# Altium project TCS-1900.PrjPcb
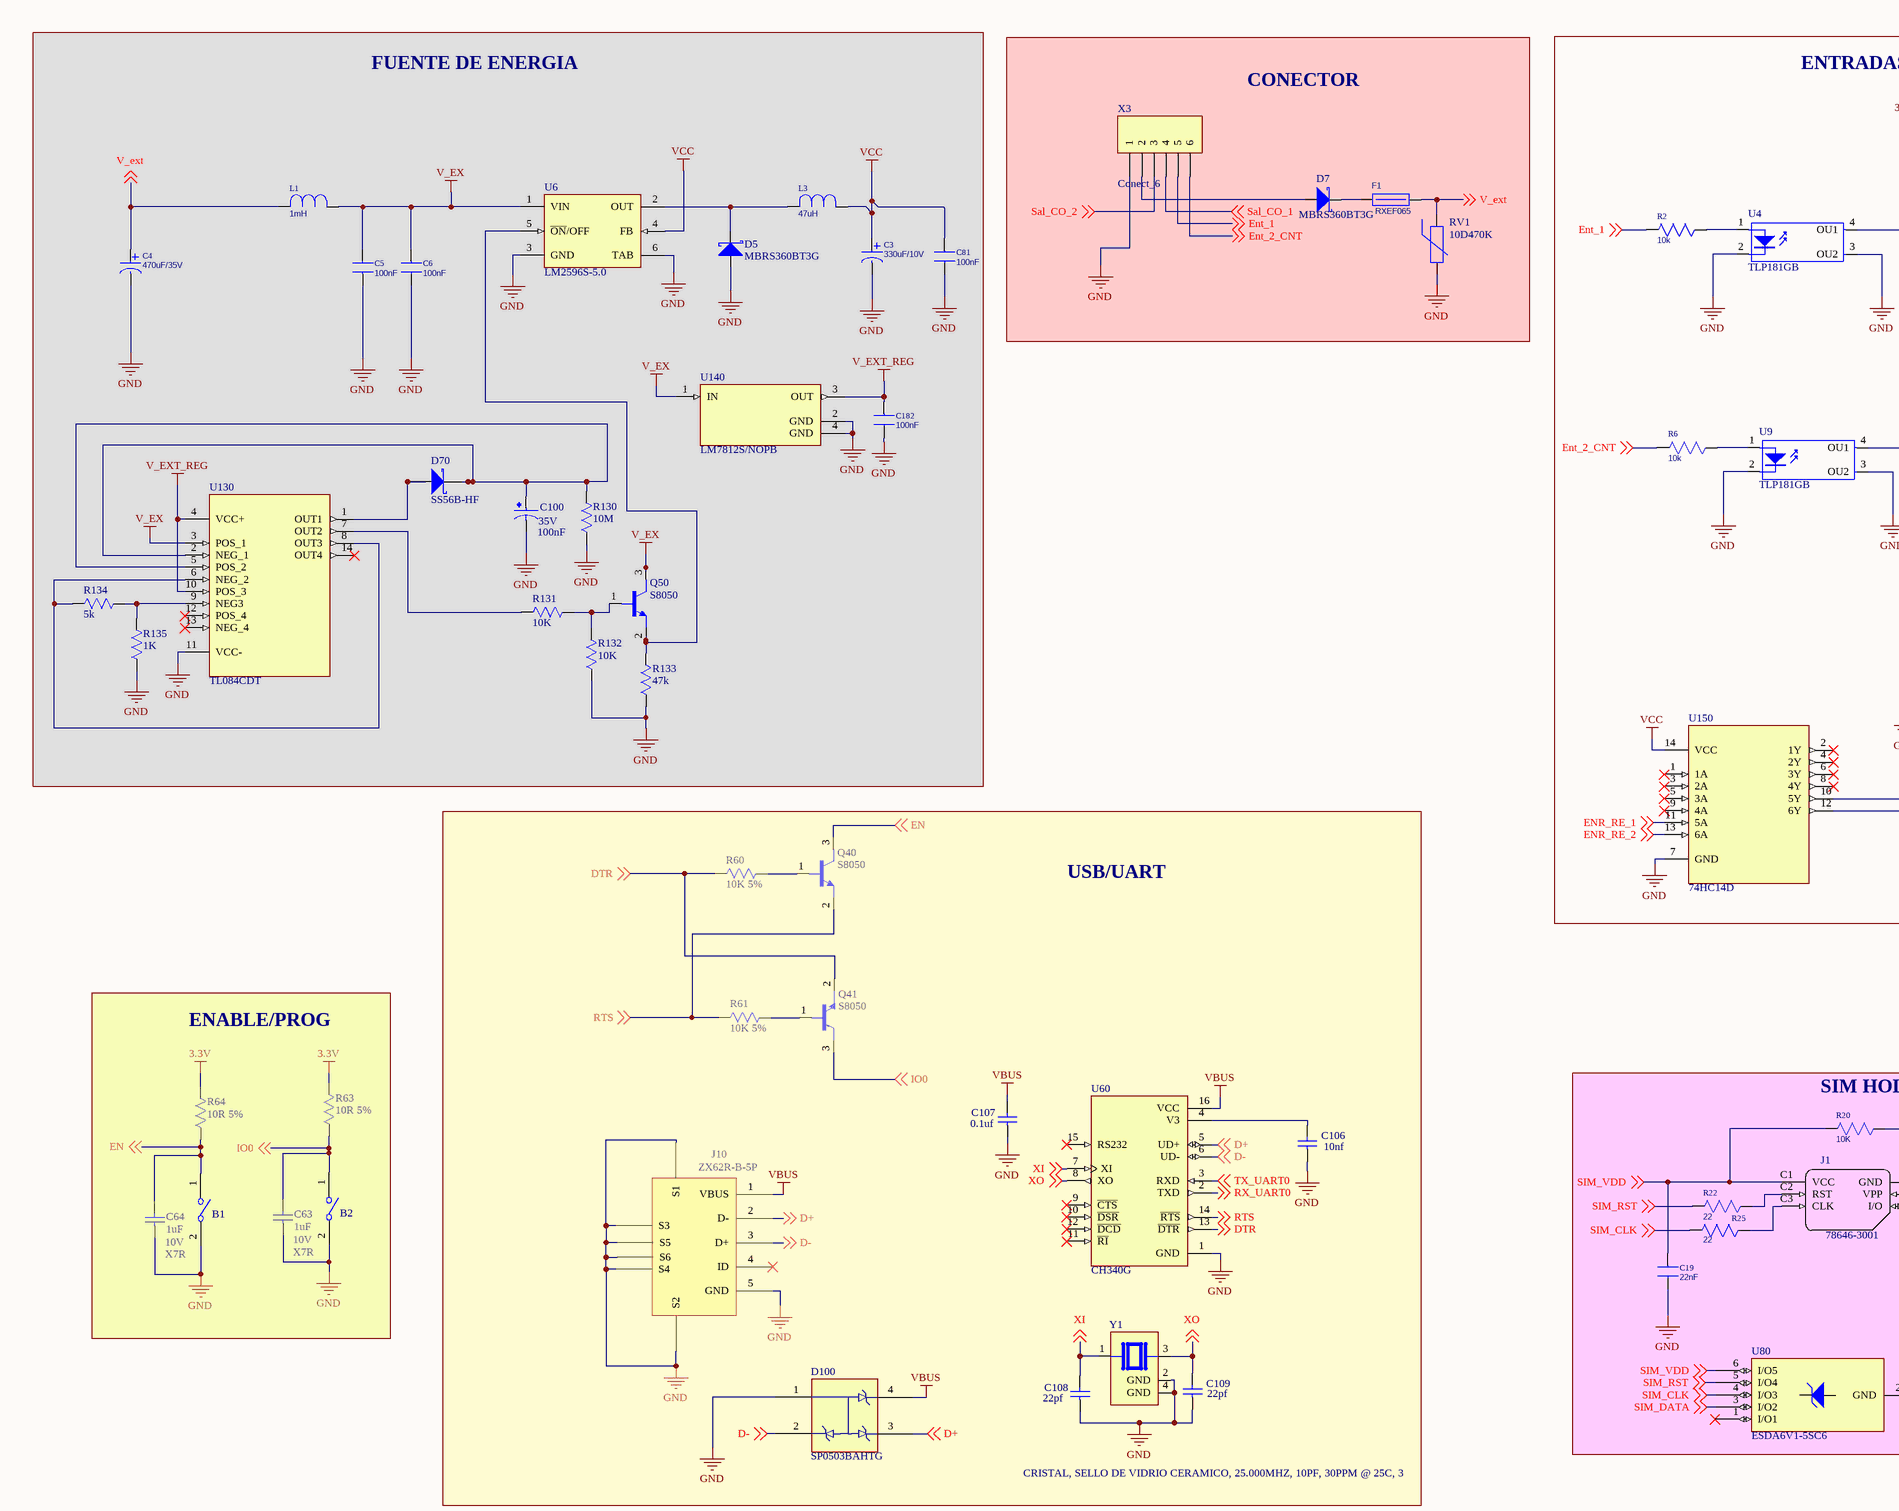
[diagram p0: TCS-1900.SchDoc, top left]
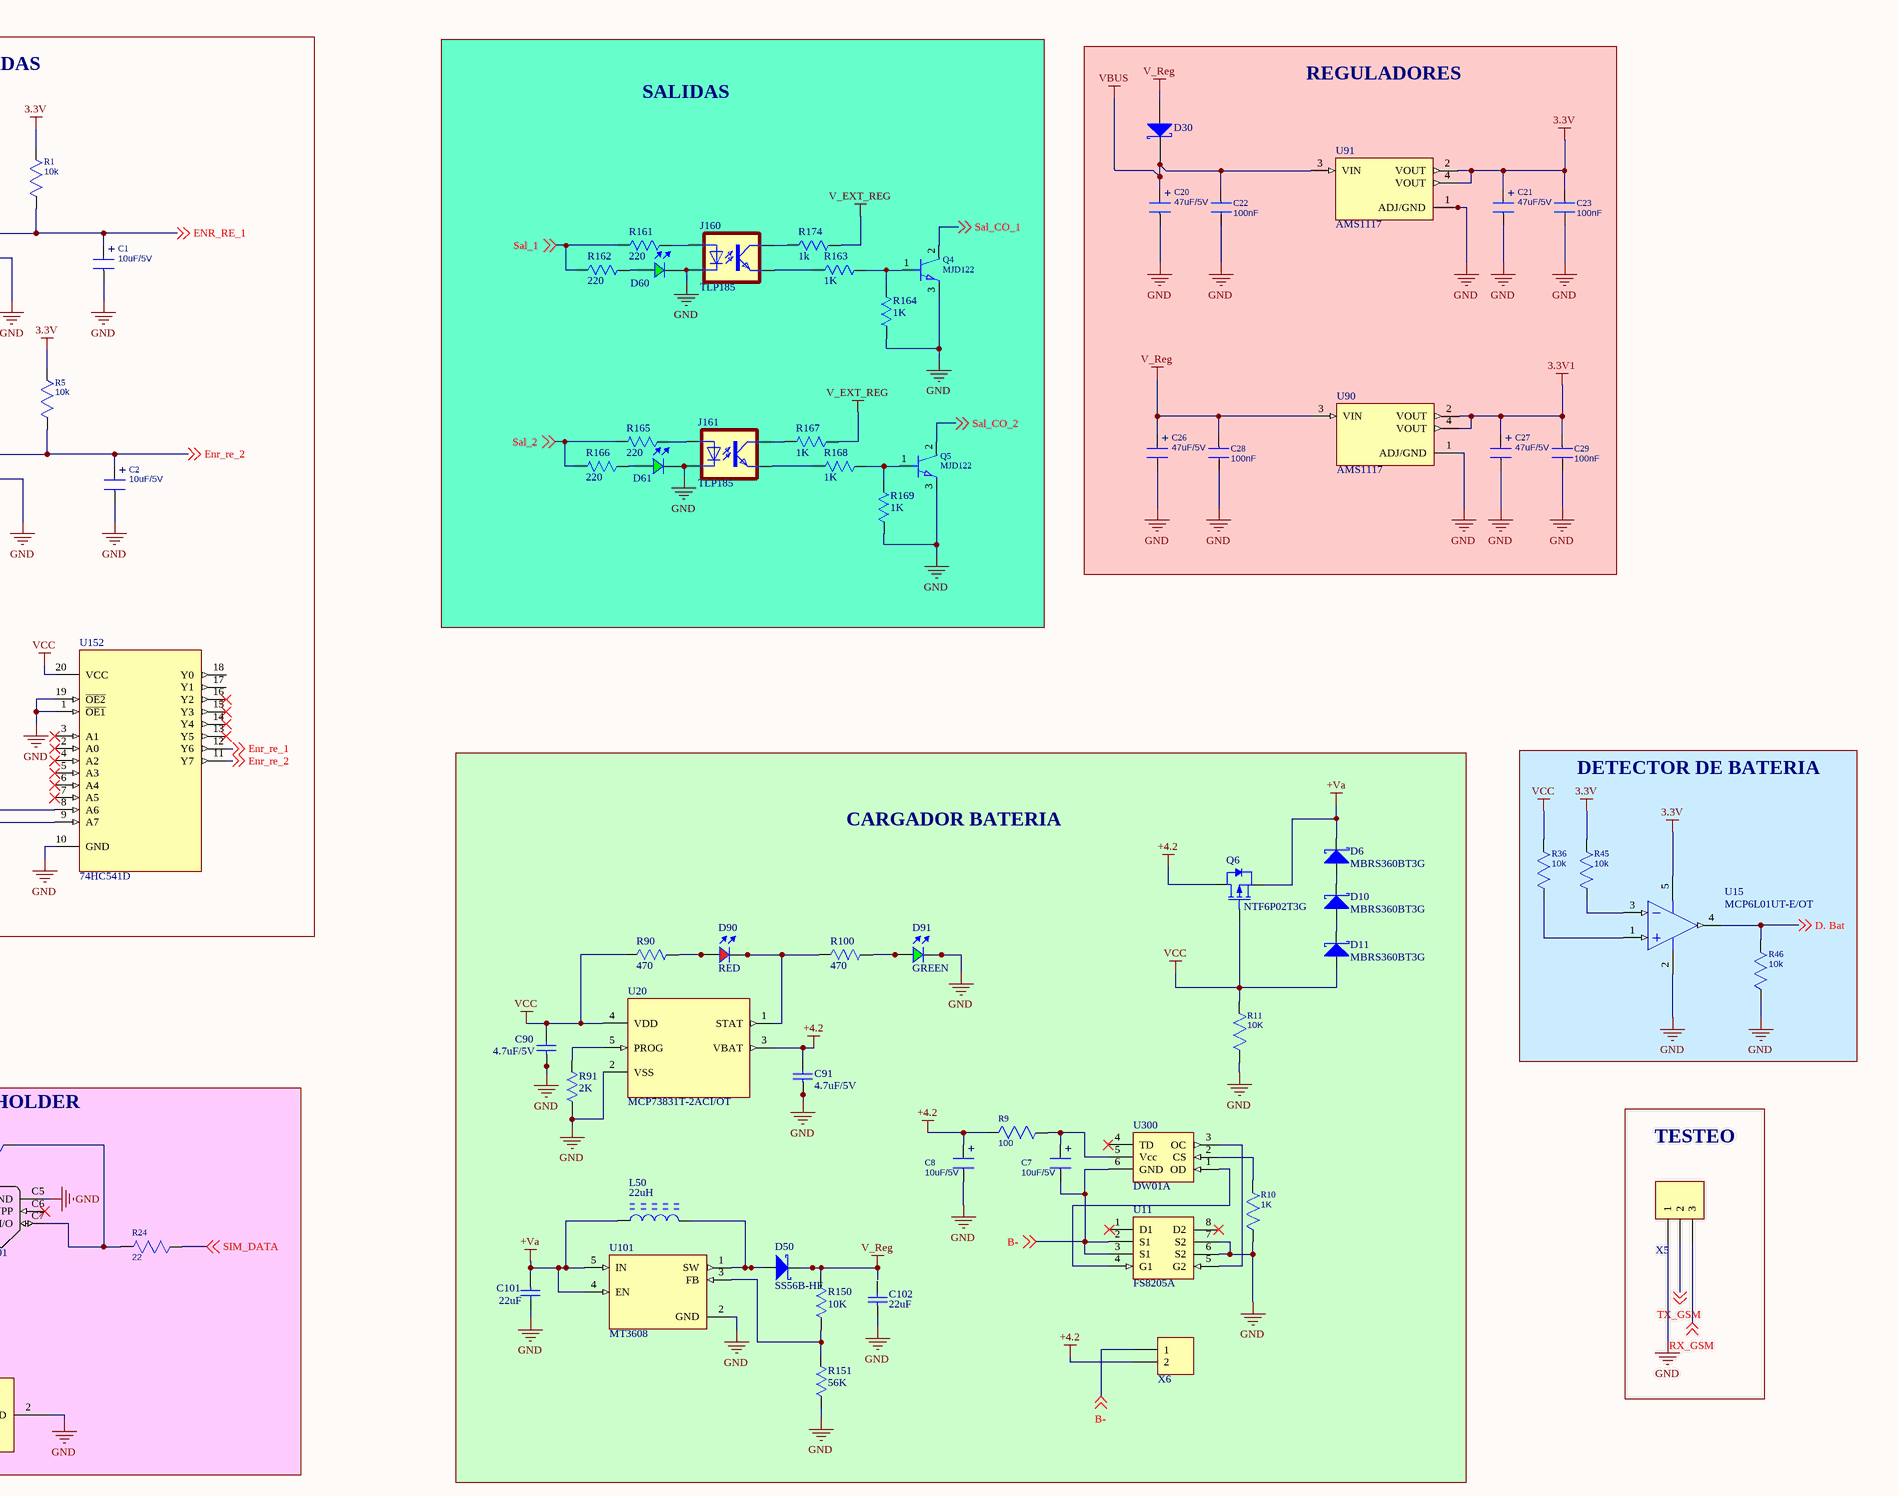
[diagram p1: TCS-1900.SchDoc, top right]
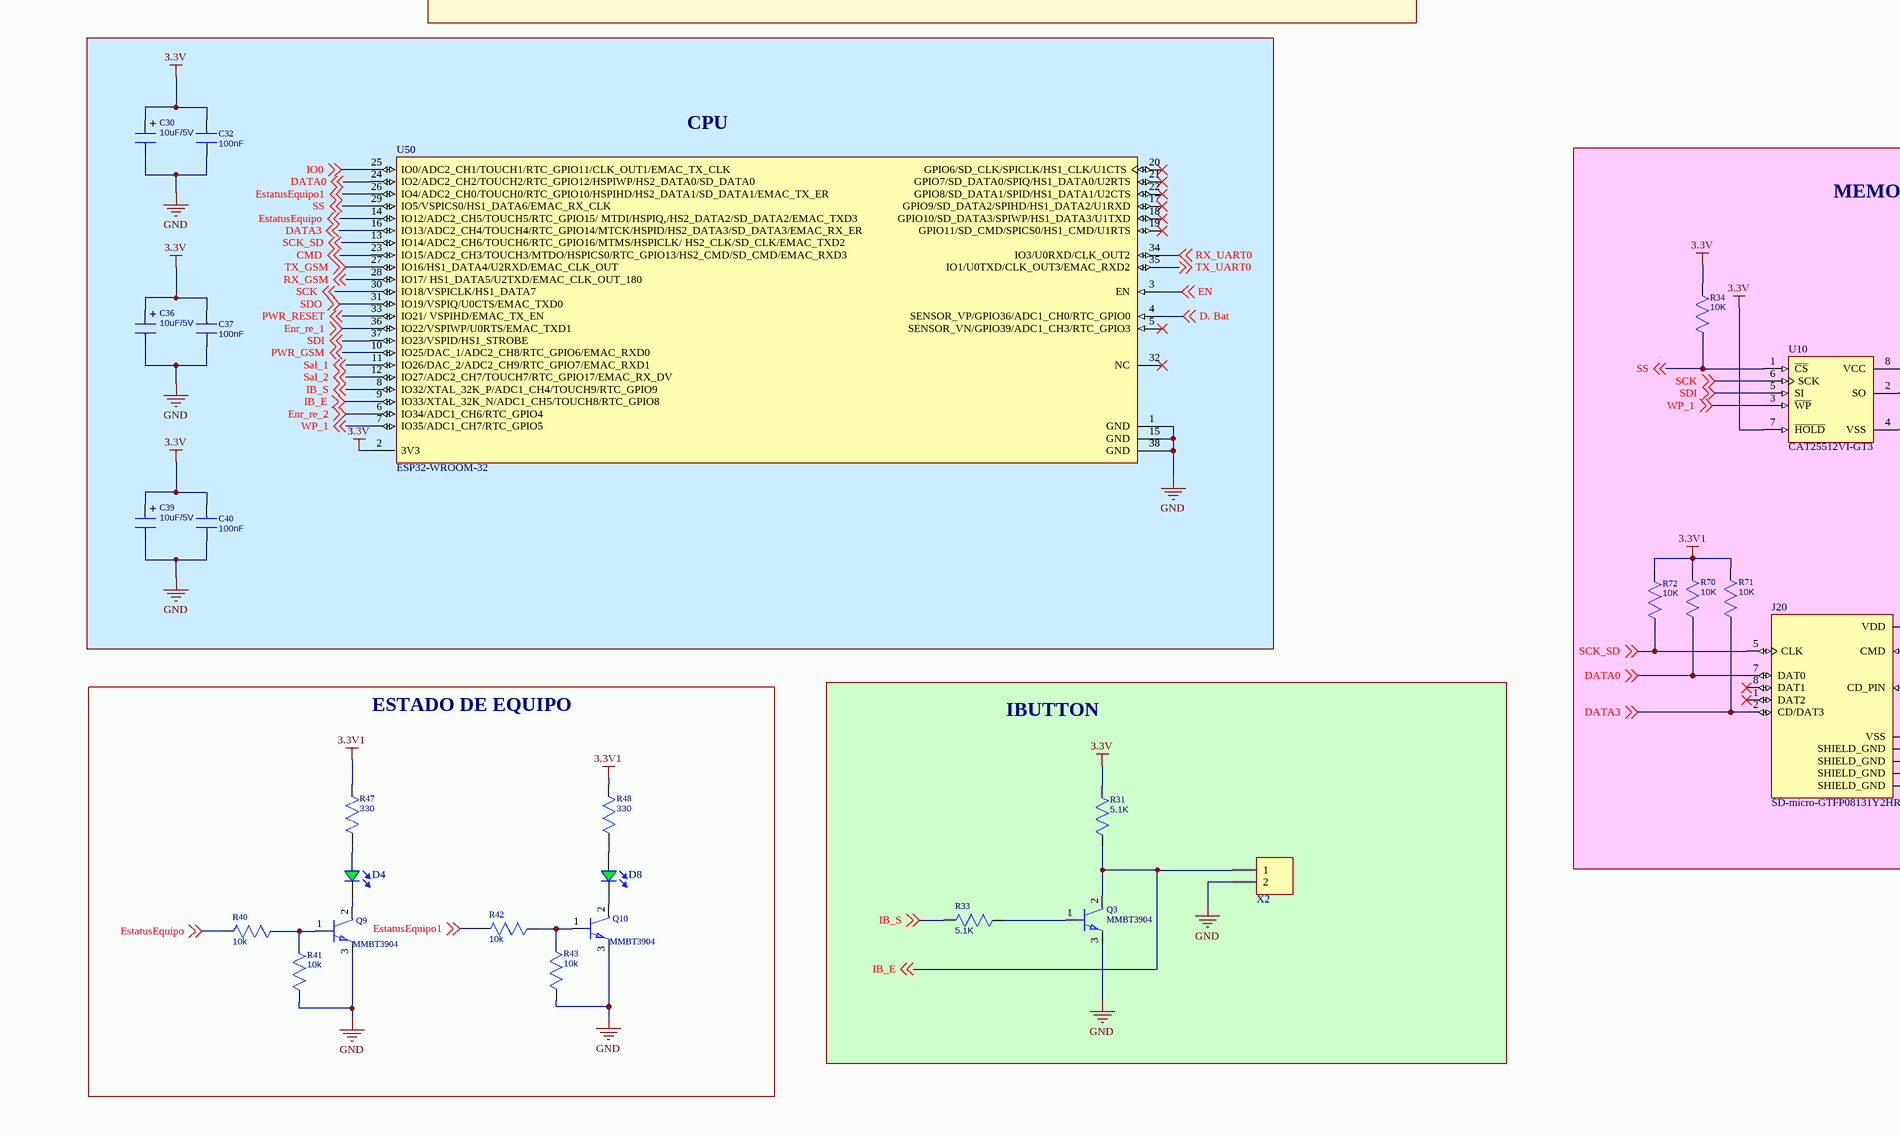
[diagram p2: TCS-1900.SchDoc, bottom left]
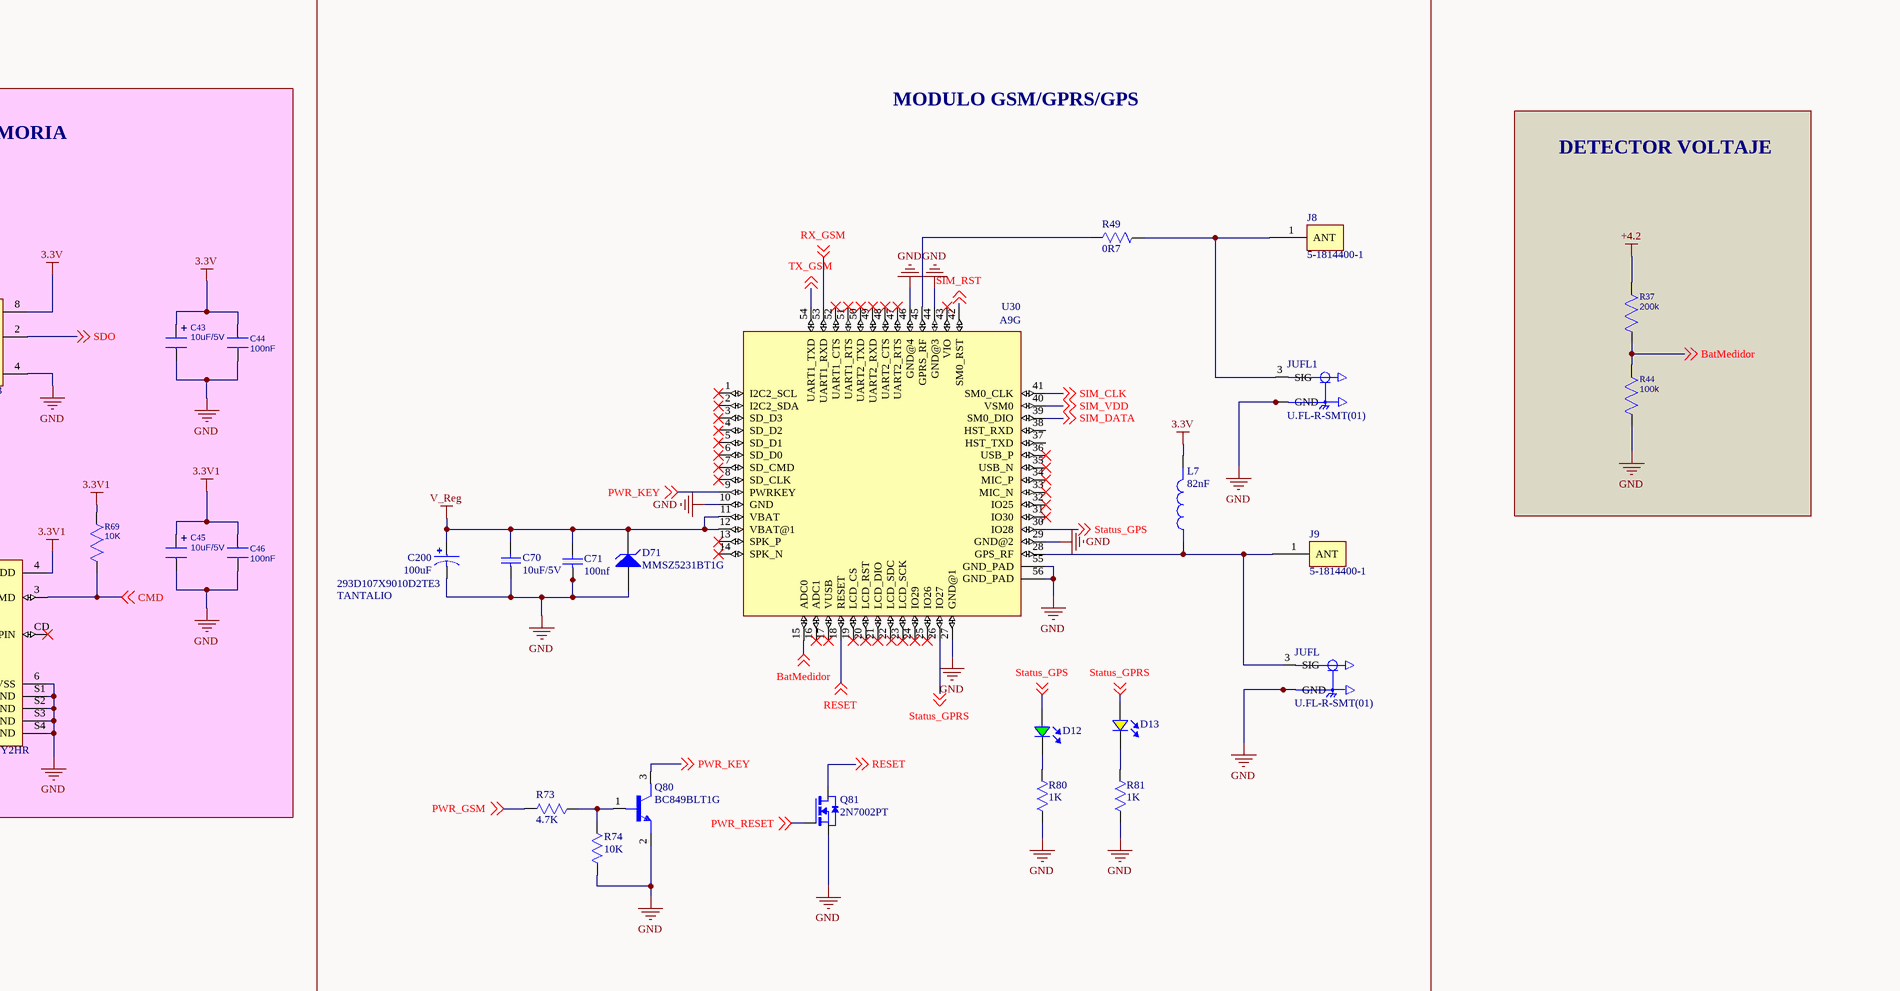
[diagram p3: TCS-1900.SchDoc, bottom right]
1 sheet, 172 parts. Net scope: global (net labels, ports and power ports of the same name join across sheets).
Board file: TCS-1900.PcbDoc

## Sheet TCS-1900.SchDoc
size A1

### Parts
B1  buton-SMD  [SW_147873-2]  (value not drawn)
B2  buton-SMD  [SW_147873-2]  (value not drawn)
C1  10uF/5V  [CT_0805]
C2  10uF/5V  [CT_0805]
C3  330uF/10V  [CPM7343-31]
C4  470uF/35V  [Cap_8x10]
C5  100nF  [Cap_poly]
C6  100nF  [C_0805]
C7  10uF/5V  [CT_0805]
C8  10uF/5V  [CT_0805]
C19  22nF  [C_0805]
C20  47uF/5V  [CT_0805]
C21  47uF/5V  [CT_0805]
C22  100nF  [C_0805]
C23  100nF  [C_0805]
C26  47uF/5V  [CT_0805]
C27  47uF/5V  [CT_0805]
C28  100nF  [C_0805]
C29  100nF  [C_0805]
C30  10uF/5V  [CT_0805]
C32  100nF  [C_0805]
C36  10uF/5V  [CT_0805]
C37  100nF  [C_0805]
C39  10uF/5V  [CT_0805]
C40  100nF  [C_0805]
C43  10uF/5V  [CT_0805]
C44  100nF  [C_0805]
C45  10uF/5V  [CT_0805]
C46  100nF  [C_0805]
C63  1uF  tension: 10V  tipo: X7R  [C_0805-3D]
C64  1uF  tension: 10V  tipo: X7R  [C_0805-3D]
C70  10uF/5V  [C_0805-3D]
C71  100nf  [C_0805-3D]
C81  100nF  [C_0805]
C90  4.7uF/5V  [C_0805-3D]
C91  4.7uF/5V  [C_0805-3D]
C100  value 100nF  max volt: 35V  [CAP_EEEFP1V221AV - duplicate]  (hidden comment: CAP)
C101  value 22uF  [C_0805-3D]  (hidden comment: capacitor caramico)
C102  value 22uF  [C_0805-3D]  (hidden comment: capacitor caramico)
C106  value 10nf  [C_0805-3D]  (hidden comment: capacitor caramico)
C107  value 0.1uf  [C_0805-3D]  (hidden comment: capacitor caramico)
C108  value 22pf  [C_0805-3D]  (hidden comment: capacitor caramico)
C109  value 22pf  [C_0805-3D]  (hidden comment: capacitor caramico)
C182  100nF  [C_0805]
C200  293D107X9010D2TE3  value 100uF  tipo: TANTALIO  [CAP-TANTALIO-PM7343X310N]
D4  LTST-C171GKT  [D_0805-GREEN]  (value not drawn)
D5  MBRS360BT3G  [p_403]
D6  MBRS360BT3G  [p_403]
D7  MBRS360BT3G  [p_403]
D8  LTST-C171GKT  [D_0805-GREEN]  (value not drawn)
D10  MBRS360BT3G  [p_403]
D11  MBRS360BT3G  [p_403]
D12  LTST-C171GKT  [D_0805-GREEN]  (value not drawn)
D13  LTST-C171GKT  [D_0805 - YELOW]  (value not drawn)
D30  SS56B-HF  [SS56B-HF DO-214AA (SMB)]  (value not drawn)
D50  SS56B-HF  [SS56B-HF DO-214AA (SMB)]
D60  LTST-C171GKT  [D_0805-GREEN]  (value not drawn)
D61  LTST-C171GKT  [D_0805-GREEN]  (value not drawn)
D70  SS56B-HF  [SS56B-HF DO-214AA (SMB)]
D71  MMSZ5231BT1G  [SOD_123]
D90  RED  [D_0805-RED]
D91  GREEN  [D_0805-GREEN]
D100  SP0503BAHTG  [SOT143]
F1  RXEF065  [Polyswitch]
J1  78646-3001  [MICRO-SIM_CARD_HOLDER_78646-3001(Primary)]
J8  5-1814400-1  [5-1814400-1]
J9  5-1814400-1  [5-1814400-1]
J10  ZX62R-B-5P  [HRS_ZX62R-B-5P]
J20  SD-micro-GTFP08131Y2HR  [AMPHENOL_GTFP08131Y2HR]
J160  TLP185  [SOP-4-2.54MM]
J161  TLP185  [SOP-4-2.54MM]
JUFL  U.FL-R-SMT(01)  [HRS_U.FL-R-SMT(01)]
JUFL1  U.FL-R-SMT(01)  [HRS_U.FL-R-SMT(01)]
L1  1mH  [Inductor_per]
L3  47uH  [CDRH127]
L7  82nF  [IND_CPI0805G1R5R-10]
L50  value 22uH  [DE0703-33]  (hidden comment: DE0703-33)
Q3  MMBT3904  [SOT23-npn]
Q4  MJD122  [DPAK]
Q5  MJD122  [DPAK]
Q6  NTF6P02T3G  [SOT223A]
Q9  MMBT3904  [SOT23-npn]
Q10  MMBT3904  [SOT23-npn]
Q40  S8050  [SOT-23]
Q41  S8050  [SOT-23]
Q50  S8050  [SOT-23]
Q80  BC849BLT1G  [SOT-23-3 (TO-236)]
Q81  2N7002PT  [SOT-416]
R1  10k  [R_0805]
R2  10k  [R_0805]
R5  10k  [R_0805]
R6  10k  [R_0805]
R9  100  [R_0805]
R10  1K  [R_0805]
R11  10K  [R_0805]
R20  10K  [R_0805]
R22  22  [R_0805]
R24  22  [R_0805]
R25  22  [R_0805]
R31  5.1K  [R_0805]
R33  5.1K  [R_0805]
R34  10K  [R_0805]
R36  10k  [R_0805]
R37  200k  [R_0805]
R40  10k  [R_0805]
R41  10k  [R_0805]
R42  10k  [R_0805]
R43  10k  [R_0805]
R44  100k  [R_0805]
R45  10k  [R_0805]
R46  10k  [R_0805]
R47  330  [R_0805]
R48  330  [R_0805]
R49  0R7  [R_0805]
R60  10K 5%  [R_0805]
R61  10K 5%  [R_0805]
R63  10R 5%  [R_0805]
R64  10R 5%  [R_0805]
R69  10K  [R_0805]
R70  10K  [R_0805]
R71  10K  [R_0805]
R72  10K  [R_0805]
R73  4.7K  [R_0805]
R74  10K  [R_0805]
R80  1K  [R_0805]
R81  1K  [R_0805]
R90  470  [R_0805]
R91  2K  [R_0805]
R100  470  [R_0805]
R130  10M  [R_0805]
R131  10K  [R_0805]
R132  10K  [R_0805]
R133  47k  [R_0805]
R134  5k  [R_0805]
R135  1K  [R_0805]
R150  10K  [R_0805]
R151  56K  [R_0805]
R161  220  [R_0805]
R162  220  [R_0805]
R163  1K  [R_0805]
R164  1K  [R_0805]
R165  220  [R_0805]
R166  220  [R_0805]
R167  1K  [R_0805]
R168  1K  [R_0805]
R169  1K  [R_0805]
R174  1k  [R_0805]
RV1  10D470K  [Varistor]
U4  TLP181GB  [SO4_2_54]
U6  LM2596S-5.0  [TS5B_N]
U9  TLP181GB  [SO4_2_54]
U10  CAT25512VI-GT3  [SOIC8_P]
U11  FS8205A  [TSSOP-8]
U15  MCP6L01UT-E/OT  [SOT23-5_P]
U20  MCP73831T-2ACI/OT  [SOT95P280X145-5N]
U30  A9G  [A9]
U50  ESP32-WROOM-32  [MODULE_ESP32-WROOM-32]
U60  CH340G  [SOIC127P600X180-16N]
U80  ESDA6V1-5SC6  [SOT-23-6]
U90  AMS1117  [SOT229P700X180-4N]
U91  AMS1117  [SOT229P700X180-4N]
U101  MT3608  [SOT95P280X145-6N]
U130  TL084CDT  [SOIC127P600X175-14N]
U140  LM7812S/NOPB  [TO254P1524X483-4N]
U150  74HC14D  [SOIC127P600X175-14N]
U152  74HC541D  [SOIC127P1032X265-20N]
U300  DW01A  [SOT23-6]
X2  Housing_2mm  [Molex2]  (value not drawn)
X3  Conect_6  [conec_6_3mm]
X5  Conect_3  [conec_3]  (value not drawn)
X6  Housing  [Molex2-90]  (value not drawn)
Y1  CRISTAL, SELLO DE VIDRIO CERAMICO, 25.000MHZ, 10PF, 30PPM @ 25C, 3  [XTAL_ABM8G25000MHZB4YT3]

### Blocks framed on the sheet
FUENTE DE ENERGIA: C3-C6 C81 C100 C182 D5 D70 L1 L3 Q50 R130-R135 U6 U130 U140
CONECTOR: D7 F1 RV1 X3
ENTRADAS: C1 C2 R1 R2 R5 R6 U4 U9 U150 U152
SALIDAS: D60 D61 J160 J161 Q4 Q5 R161-R169 R174
REGULADORES: C20-C23 C26-C29 D30 U90 U91
CARGADOR BATERIA: C7 C8 C90 C91 C101 C102 D6 D10 D11 D50 D90 D91 L50 Q6 R9-R11 R90 R91 R100 R150 R151 U11 U20 U101 U300 X6
DETECTOR DE BATERIA: R36 R45 R46 U15
USB/UART: C106-C109 D100 J10 Q40 Q41 R60 R61 U60 Y1
ENABLE/PROG: B1 B2 C63 C64 R63 R64
SIM HOLDER: C19 J1 R20 R22 R24 R25 U80
TESTEO: X5
CPU: C30 C32 C36 C37 C39 C40 U50
MODULO GSM/GPRS/GPS: C70 C71 C200 D12 D13 D71 J8 J9 JUFL JUFL1 L7 Q80 Q81 R49 R73 R74 R80 R81 U30
MEMORIA: C43-C46 J20 R34 R69-R72 U10
DETECTOR VOLTAJE: R37 R44
ESTADO DE EQUIPO: D4 D8 Q9 Q10 R40-R43 R47 R48
IBUTTON: Q3 R31 R33 X2

### Nets
3.3V: C21.1 C23.2 C30.1 C32.2 C36.1 C37.2 C39.1 C40.2 C43.1 C44.2 L7.2 R1.1 R5.1 R31.1 R34.1 R45.1 R63.2 R64.2 U10.7(~{HOLD}) U10.8(VCC) U15.5(VDD) U50.2(3V3) U91.2(VOUT) U91.4(VOUT)
3.3V1: C27.1 C29.2 C45.1 C46.2 J20.4(VDD) R47.2 R48.2 R69.1 R70.1 R71.1 R72.1 U90.2(VOUT) U90.4(VOUT)
+4.2: C8.1 C91.2 Q6.2(D) R9.1 R37.1 U20.3(VBAT) X6.2
+Va: C101.1 D6.2(K) L50.1 Q6.3(S) U101.4(EN) U101.5(IN)
GND: B1.2 B2.2 C1.2 C2.2 C3.2 C4.2 C5.2 C6.1 C8.2 C19.1 C20.2 C21.2 C22.1 C23.1 C26.2 C27.2 C28.1 C29.1 C30.2 C32.1 C36.2 C37.1 C39.2 C40.1 C43.2 C44.1 C45.2 C46.1 C63.1 C64.1 C70.1 C71.1 C81.1 C90.1 C91.1 C100.2 C101.2 C102.1 C106.1 C107.1 C108.1 C109.1 C182.1 C200.2 D5.1(A) D60.2 D61.2 D71.1 D91.2 D100.1 J1.C5(GND) J10.5(GND) J10.12(S1) J10.13(S3) J10.14(S5) J10.15(S6) J10.16(S2) J10.17(S4) J20.6(VSS) J20.S1(SHIELD_GND) J20.S2(SHIELD_GND) J20.S3(SHIELD_GND) J20.S4(SHIELD_GND) J160.CATHODE(C) J161.CATHODE(C) JUFL.1(GND) JUFL.2(GND) JUFL1.1(GND) JUFL1.2(GND) Q3.3 Q4.3 Q5.3 Q9.3 Q10.3 Q80.2(E) Q81.3(S) R10.2 R11.1 R41.2 R43.2 R44.2 R46.2 R74.2 R80.1 R81.1 R91.1 R130.1 R132.1 R133.1 R135.1 R151.1 R164.1 R169.2 RV1.1 U4.2(K) U4.3(OU2) U6.3(GND) U6.6(TAB) U9.2(K) U9.3(OU2) U10.4(VSS) U11.6(S2) U11.7(S2) U15.2(VSS) U20.2(VSS) U30.10(GND) U30.27(GND@1) U30.29(GND@2) U30.44(GND@3) U30.46(GND@4) U30.55(GND_PAD) U30.56(GND_PAD) U50.1(GND) U50.15(GND) U50.38(GND) U60.1(GND) U80.2(GND) U90.1(ADJ/GND) U91.1(ADJ/GND) U101.2(GND) U130.11(VCC-) U140.2(GND) U140.4(GND) U150.7(GND) U152.1(~{OE1}) U152.10(GND) U152.19(~{OE2}) X2.2 X3.1 X5.1 Y1.2(GND) Y1.4(GND)
V_EX: C5.1 C6.2 L1.1 Q50.3(C) U6.1(VIN) U130.3(POS_1) U140.1(IN)
V_EXT_REG: C182.2 R167.1 R174.2 U130.4(VCC+) U130.10(POS_3) U140.3(OUT)
V_Reg: C26.1 C28.2 C70.2 C71.2 C200.1 D30.1 D50.2 D71.2 R150.2 U30.11(VBAT) U30.12(VBAT@1) U90.3(VIN)
VBUS: C20.1 C22.2 C107.2 D30.2 D100.4 J10.1(VBUS) U60.16(VCC) U91.3(VIN)
VCC: C3.1 C81.2 C90.2 D11.1(A) L3.1 Q6.1(G) R11.2 R36.1 R90.1 U6.4(FB) U20.4(VDD) U150.14(VCC) U152.20(VCC)
B-: C7.2 U11.2(S1) U11.3(S1) U300.6(GND) X6.1 ; off-sheet B-
BatMedidor: R37.2 R44.1 U30.15(ADC0) ; off-sheet BatMedidor
CMD: J20.3(CMD) R69.2 U50.23(IO15/ADC2_CH3/TOUCH3/MTDO/HSPICS0/RTC_GPIO13/HS2_CMD/SD_CMD/EMAC_RXD3) ; off-sheet CMD
D+: D100.3 J10.2(D-) U60.5(UD+) ; off-sheet D+
D-: D100.2 J10.3(D+) U60.6(UD-) ; off-sheet D-
D. Bat: R46.1 U15.4(VOUT) U50.4(SENSOR_VP/GPIO36/ADC1_CH0/RTC_GPIO0) ; off-sheet D. Bat
DATA0: J20.7(DAT0) R70.2 U50.24(IO2/ADC2_CH2/TOUCH2/RTC_GPIO12/HSPIWP/HS2_DATA0/SD_DATA0) ; off-sheet DATA0
DATA3: J20.2(CD/DAT3) R71.2 U50.16(IO13/ADC2_CH4/TOUCH4/RTC_GPIO14/MTCK/HSPID/HS2_DATA3/SD_DATA3/EMAC_RX_ER) ; off-sheet DATA3
DTR: Q41.2(E) R60.1 U60.13(~{DTR}) ; off-sheet DTR
EN: B1.1 C64.2 Q40.3(C) R64.1 U50.3(EN) ; off-sheet EN
ENR_RE_1: C1.1 R1.2 U4.4(OU1) U50.36(IO22/VSPIWP/U0RTS/EMAC_TXD1) U150.11(5A) U152.12(Y6) ; off-sheet ENR_RE_1, off-sheet Enr_re_1
Enr_re_2: C2.1 R5.2 U9.4(OU1) U50.6(IO34/ADC1_CH6/RTC_GPIO4) U150.13(6A) U152.11(Y7) ; off-sheet Enr_re_2, off-sheet ENR_RE_2
Ent_1: R2.2 X3.5 ; off-sheet Ent_1
Ent_2_CNT: R6.2 X3.6 ; off-sheet Ent_2_CNT
EstatusEquipo: R40.2 U50.14(IO12/ADC2_CH5/TOUCH5/RTC_GPIO15/_MTDI/HSPIQ,/HS2_DATA2/SD_DATA2/EMAC_TXD3) ; off-sheet EstatusEquipo
EstatusEquipo1: R42.2 U50.26(IO4/ADC2_CH0/TOUCH0/RTC_GPIO10/HSPIHD/HS2_DATA1/SD_DATA1/EMAC_TX_ER) ; off-sheet EstatusEquipo1
IB_E: Q3.2 R31.2 U50.9(IO33/XTAL_32K_N/ADC1_CH5/TOUCH8/RTC_GPIO8) X2.1 ; off-sheet IB_E
IB_S: R33.2 U50.8(IO32/XTAL_32K_P/ADC1_CH4/TOUCH9/RTC_GPIO9) ; off-sheet IB_S
IO0: B2.1 C63.2 Q41.3 R63.1 U50.25(IO0/ADC2_CH1/TOUCH1/RTC_GPIO11/CLK_OUT1/EMAC_TX_CLK) ; off-sheet IO0
PWR_GSM: R73.2 U50.10(IO25/DAC_1/ADC2_CH8/RTC_GPIO6/EMAC_RXD0) ; off-sheet PWR_GSM
PWR_KEY: Q80.3(C) U30.9(PWRKEY) ; off-sheet PWR_KEY
PWR_RESET: Q81.2(G) U50.33(IO21/_VSPIHD/EMAC_TX_EN) ; off-sheet PWR_RESET
RESET: Q81.1(D) U30.18(RESET) ; off-sheet RESET
RTS: Q40.2(E) R61.1 U60.14(~{RTS}) ; off-sheet RTS
RX_GSM: U30.53(UART1_RXD) U50.28(IO17/_HS1_DATA5/U2TXD/EMAC_CLK_OUT_180) X5.3 ; off-sheet RX_GSM
RX_UART0: U50.34(IO3/U0RXD/CLK_OUT2) U60.2(TXD) ; off-sheet RX_UART0
Sal_1: R161.1 R162.1 U50.11(IO26/DAC_2/ADC2_CH9/RTC_GPIO7/EMAC_RXD1) ; off-sheet Sal_1
Sal_2: R165.2 R166.2 U50.12(IO27/ADC2_CH7/TOUCH7/RTC_GPIO17/EMAC_RX_DV) ; off-sheet Sal_2
Sal_CO_1: Q4.2 X3.4 ; off-sheet Sal_CO_1
Sal_CO_2: Q5.2 X3.3 ; off-sheet Sal_CO_2
SCK: U10.6(SCK) U50.30(IO18/VSPICLK/HS1_DATA7) ; off-sheet SCK
SCK_SD: J20.5(CLK) R72.2 U50.13(IO14/ADC2_CH6/TOUCH6/RTC_GPIO16/MTMS/HSPICLK/_HS2_CLK/SD_CLK/EMAC_TXD2) ; off-sheet SCK_SD
SDI: U10.5(SI) U50.37(IO23/VSPID/HS1_STROBE) ; off-sheet SDI
SDO: U10.2(SO) U50.31(IO19/VSPIQ/U0CTS/EMAC_TXD0) ; off-sheet SDO
SIM_CLK: R25.2 U30.41(SM0_CLK) U80.4(I/O3) ; off-sheet SIM_CLK
SIM_DATA: R24.1 U30.39(SM0_DIO) U80.3(I/O2) ; off-sheet SIM_DATA
SIM_RST: R22.2 U30.42(SM0_RST) U80.5(I/O4) ; off-sheet SIM_RST
SIM_VDD: C19.2 J1.C1(VCC) R20.2 U30.40(VSM0) U80.6(I/O5) ; off-sheet SIM_VDD
SS: R34.2 U10.1(~{CS}) U50.29(IO5/VSPICS0/HS1_DATA6/EMAC_RX_CLK) ; off-sheet SS
Status_GPRS: D13.1 U30.26(IO27) ; off-sheet Status_GPRS
Status_GPS: D12.1 U30.30(IO28) ; off-sheet Status_GPS
TX_GSM: U30.54(UART1_TXD) U50.27(IO16/HS1_DATA4/U2RXD/EMAC_CLK_OUT) X5.2 ; off-sheet TX_GSM
TX_UART0: U50.35(IO1/U0TXD/CLK_OUT3/EMAC_RXD2) U60.3(RXD) ; off-sheet TX_UART0
V_ext: C4.1 F1.1 L1.2 RV1.2 ; off-sheet V_ext
WP_1: U10.3(~{WP}) U50.7(IO35/ADC1_CH7/RTC_GPIO5) ; off-sheet WP_1
XI: C108.2 U60.7(XI) Y1.1 ; off-sheet XI
XO: C109.2 U60.8(XO) Y1.3 ; off-sheet XO
NetC7_1: C7.1 R9.2 U300.5(Vcc)
NetC100_1: C100.1 D70.2 R130.2 U130.2(NEG_1) U130.5(POS_2)
NetC106_2: C106.2 U60.4(V3)
NetD4_1: D4.1 R47.1
NetD4_2: D4.2 Q9.2
NetD5_2: D5.2(K) L3.2 U6.2(OUT)
NetD6_1: D6.1(A) D10.2(K)
NetD7_1: D7.1(A) X3.2
NetD7_2: D7.2(K) F1.2
NetD8_1: D8.1 R48.1
NetD8_2: D8.2 Q10.2
NetD10_1: D10.1(A) D11.2(K)
NetD12_2: D12.2 R80.2
NetD13_2: D13.2 R81.2
NetD50_1: D50.1 L50.2 U101.1(SW)
NetD60_1: D60.1 R162.2
NetD61_1: D61.1 R166.1
NetD70_1: D70.1 U130.1(OUT1)
NetD90_1: D90.1 R90.2
NetD90_2: D90.2 R100.1 U20.1(STAT)
NetD91_1: D91.1 R100.2
NetJ1_C2: J1.C2(RST) R22.1
NetJ1_C3: J1.C3(CLK) R25.1
NetJ1_C7: J1.C7(I/O) R20.1 R24.2
NetJ8_1: J8.1(ANT) JUFL1.3(SIG) R49.2
NetJ9_1: J9.1(ANT) JUFL.3(SIG) L7.1 U30.28(GPS_RF)
NetJ160_ANODE: J160.ANODE(A) R161.2
NetJ160_COLLECTOR: J160.COLLECTOR(COL) R174.1
NetJ160_EMITTER: J160.EMITTER(EMIT) R163.1
NetJ161_ANODE: J161.ANODE(A) R165.1
NetJ161_COLLECTOR: J161.COLLECTOR(COL) R167.2
NetJ161_EMITTER: J161.EMITTER(EMIT) R168.2
NetQ3_1: Q3.1 R33.1
NetQ4_1: Q4.1 R163.2 R164.2
NetQ5_1: Q5.1 R168.1 R169.1
NetQ9_1: Q9.1 R40.1 R41.1
NetQ10_1: Q10.1 R42.1 R43.1
NetQ40_1: Q40.1(B) R60.2
NetQ41_1: Q41.1(B) R61.2
NetQ50_1: Q50.1(B) R131.2 R132.2
NetQ50_2: Q50.2(E) R133.2 U6.5(~{ON}/OFF)
NetQ80_1: Q80.1(B) R73.1 R74.1
NetR2_1: R2.1 U4.1(A)
NetR6_1: R6.1 U9.1(A)
NetR10_1: R10.1 U300.2(CS)
NetR36_2: R36.2 U15.1(VIN+)
NetR45_2: R45.2 U15.3(VIN-)
NetR49_1: R49.1 U30.45(GPRS_RF)
NetR91_2: R91.2 U20.5(PROG)
NetR131_1: R131.1 U130.7(OUT2)
NetR134_1: R134.1 U130.6(NEG_2) U130.8(OUT3)
NetR134_2: R134.2 R135.2 U130.9(NEG3)
NetR150_1: R150.1 R151.2 U101.3(FB)
NetU11_4: U11.4(G1) U300.1(OD)
NetU11_5: U11.5(G2) U300.3(OC)
NetU150_10: U150.10(5Y) U152.8(A6)
NetU150_12: U150.12(6Y) U152.9(A7)

Not connected (* = marked no-connect by the designer): C102 2; J1 C6(VPP)*; J10 4(ID)*; J20 1(DAT2)* 8(DAT1)* CD(CD_PIN)*; U11 1(D1) 8(D2)*; U30 1(I2C2_SCL)* 2(I2C2_SDA)* 3(SD_D3)* 4(SD_D2)* 5(SD_D1)* 6(SD_D0)* 7(SD_CMD)* 8(SD_CLK)* 13(SPK_P)* 14(SPK_N)* 16(ADC1)* 17(VUSB)* 19(LCD_CS)* 20(LCD_RST)* 21(LCD_DIO)* 22(LCD_SDC) 23(LCD_SCK)* 24(IO29)* 25(IO26)* 31(IO30)* 32(IO25)* 33(MIC_N)* 34(MIC_P)* 35(USB_N)* 36(USB_P)* 37(HST_TXD) 38(HST_RXD) 43(VIO)* 47(UART2_RTS)* 48(UART2_CTS)* 49(UART2_RXD)* 50(UART2_TXD)* 51(UART1_RTS)* 52(UART1_CTS)*; U50 5(SENSOR_VN/GPIO39/ADC1_CH3/RTC_GPIO3)* 17(GPIO9/SD_DATA2/SPIHD/HS1_DATA2/U1RXD)* 18(GPIO10/SD_DATA3/SPIWP/HS1_DATA3/U1TXD)* 19(GPIO11/SD_CMD/SPICS0/HS1_CMD/U1RTS)* 20(GPIO6/SD_CLK/SPICLK/HS1_CLK/U1CTS)* 21(GPIO7/SD_DATA0/SPIQ/HS1_DATA0/U2RTS)* 22(GPIO8/SD_DATA1/SPID/HS1_DATA1/U2CTS)* 32(NC)*; U60 9(~{CTS})* 10(~{DSR})* 11(~{RI})* 12(~{DCD})* 15(RS232)*; U80 1(I/O1)*; U130 12(POS_4)* 13(NEG_4)* 14(OUT4)*; U150 1(1A)* 2(1Y)* 3(2A)* 4(2Y)* 5(3A)* 6(3Y)* 8(4Y)* 9(4A)*; U152 2(A0)* 3(A1)* 4(A2)* 5(A3)* 6(A4)* 7(A5)* 13(Y5)* 14(Y4)* 15(Y3)* 16(Y2)* 17(Y1) 18(Y0); U300 4(TD)*

### Notes on the sheet
- (in symbol CapTantalio) +

### Library data of the parts
C1 C2 C7 C8 C20 C21 C26 C27 C30 C36 C39 C43 C45 = CapTantalio: Capacitor
  C1 C2 C7 C8 C30 C36 C39 C43 C45: Value: 10uF/5V
  C20 C21 C26 C27: Value: 47uF/5V
C3 C4 = Cap_alu: Capacitor aluminio
  C3: Value: 330uF/10V
  C4: Value: 470uF/35V
C5 C6 C19 C22 C23 C28 C29 C32 C37 C40 C44 C46 C81 C182 = CapMix: Capacitor
  C5 C6 C22 C23 C28 C29 C32 C37 C40 C44 C46 C81 C182: Value: 100nF
  C19: Value: 22nF
C63 C64 C70 C71 C90 C91 C101 C102 C106-C109 = capacitor caramico: capacitor ceramico 0805
C100 = CAP_EEEFP1V221AV: CAP ALUM
C200 = CAP-TANTALIO-(7343 métrico): Capacitores de tantalio moldeado de 100 µF 10 V 2917 (7343 métrico) 600 mOhm; marca: Vishay Sprague
D4 D8 D12 D60 D61 = LED-SMD-GREEN
D5-D7 D10 D11 = MBRS360BT3G: Schottky Diode
D13 = LED-SMD-YELLOW
D30 D50 D70 = SS56B-HF: Diodo Schottky 60 V 5A Montaje en superficie DO-214AA (SMB); part number: SS56B-HF; value: Diodo Schottky 60 V 5A; pakage: DO-214AA (SMB)
D71 = Diodo Zener-MMSZ5231BT1G: Diodo Zener 5,1 V 500 mW ±5 % Montaje en superficie SOD-123
D90 = LED-SMD: led 0805 red
D91 = LED-SMD-GREEN: value: LTST-C171GKT
D100 = SP0503BAHTG: Supresor ESD TVS Uni-Dir 5.5V 4-Pin SOT-143 T/R
F1 = Fuse_per: Fuse; Value: RXEF065
J1 = 78646-3001: Conn Micro SIM Card SKT 6 POS 2.54mm Solder RA SMD 0.5A/Contact Embossed T/R; MF: Molex; Price: 0.58 USD; Availability: Good; MP: 78646-3001; Package: None; Value: *
J8 J9 = 5-1814400-1: SMA Connector Jack, Female Socket 50 Ohm Through Hole, Right Angle Solder; Vendor: Tyco Electronics; Manufacturer_Part_Number: 5-1814400-1
J10 = USB-ZX62R-B-5P: ZX62R-B-5P USB STM; tecnoligi: SMD; value: ZX62R-B-5P
J20 = SD-micro-GTFP08131Y2HR: GTFP08131Y2HR  MICRO SD,P/P,LCP; MF: GTFP08131Y2HR
J160 J161 = TLP185: Optoisolator Transistor Output 3750Vrms 1 Channel 6-SOP; MF: Toshiba; Price: None; Availability: In Stock; MP: TLP185; Package: None; SnapEDA_Link: https://www.snapeda.com/parts/TLP185/Toshiba/view-part/?ref=snap; Check_prices: https://www.snapeda.com/parts/TLP185/Toshiba/view-part/?ref=eda; Value: *; Purchase-URL: https://pricing.snapeda.com/search/part/TLP185/?ref=eda
JUFL JUFL1 = U.FL-R-SMT(01): U.FL (UMCC) Connector Receptacle, Male Pin 50Ohm Surface Mount Solder. RF Connectors / Coaxial Connectors; MF: Hirose; Check_prices: https://www.snapeda.com/parts/U.FL-R-SMT(01)/Hirose+Electric+Co+Ltd/view-part/?ref=eda; Value: *; Availability: In Stock; MP: U.FL-R-SMT(01); Price: None; Package: None; SnapEDA_Link: https://www.snapeda.com/parts/U.FL-R-SMT(01)/Hirose+Electric+Co+Ltd/view-part/?ref=snap; Purchase-URL: https://pricing.snapeda.com/search/part/U.FL-R-SMT(01)/?ref=eda
L1 = Inductor_per: Inductor; Value: 1mH
L3 = L_CDRH127: Inductor; Value: 47uH
L7 = INDUCTOR-0805: inductor 0805
L50 = DE0703-33: Inductor: alambre; SMD; 33uH; 910mA; 240 mΩ; 7,3x7,3x3,2 mm; ±20%
Q3 Q9 Q10 = NPN_SOT23
Q6 = NTF6P02T3G: 20V P-Channel Enhancement Mode MOSFET; Published: 17-Dec-2003; DatasheetVersion: Jul-99; PackageVersion: 1996; PackageReference: SOT23; Publisher: Altium Limited; PackageDescription: SOT-23; 3 Leads; Body 3.1 x 2.5 mm, inc. leads (LxW max), Alternate Lead Configuration; ComponentLink1Description: Manufacturer Link; ComponentLink1URL: http://www.zetex.com/; ComponentLink2Description: Datasheet; ComponentLink2URL: www.zetex.com/3.0/pdf/ZXM61P02F.pdf
Q40 Q50 = transistor-smd-NPN-BJT: Transistor bipolar (BJT) NPN 25 V 500 mA 150 MHz 300 mW Montaje en superficie SOT-23
Q41 = transistor-smd-NPN-BJT-espejado: Transistor bipolar (BJT) NPN 25 V 500 mA 150 MHz 300 mW Montaje en superficie SOT-23
Q80 = TRANSISTOR-NPN: Transistor bipolar (BJT) NPN 30 V 100 mA 100 MHz 300 mW Montaje en superficie SOT-23-3 (TO-236)
Q81 = 2N7002PT: N-Channel 60 V 310mA (Ta) 250mW (Ta) Surface Mount SC-75; MP: 2N7002PT; package: SOT-416 NXP USA Inc.
R1 R2 R5 R6 R9-R11 R20 R22 R24 R25 R31 R33 R34 R36 R37 R40-R48 R69-R72 = ResSmd: Resistor
  R1 R2 R5 R6 R36 R40-R43 R45 R46: Value: 10k
  R9: Value: 100
  R10: Value: 1K
  R11 R20 R34 R69-R72: Value: 10K
  R22 R24 R25: Value: 22
  R31 R33: Value: 5.1K
  R37: Value: 200k
  R44: Value: 100k
  R47 R48: Value: 330
R49 R60 R61 R63 R64 R73 R74 R80 R81 R90 R91 R100 R130-R135 R150 R151 R161-R169 R174 = Resistor
RV1 = Varistor
U4 U9 = OptoMOS_SO4: 4-Pin Phototransistor Optocoupler; Published: 24-Mar-1999; LatestRevisionDate: 04-Mar-2005; LatestRevisionNote: Sch pins 3 & 4 Swapped.; DatasheetVersion: Nov-2003; PackageReference: SO-4; Publisher: Altium Limited
U6 = LM2596S-5.0: SIMPLE SWITCHER® Power Converter 150 KHz 3A Step-Down Voltage Regulator, 5-pin TO-263; Manufacturer: National Semiconductor; PackageTopMarking: NSUZXYTTE#*LM2596S*-5.0 P+; PowerWise: N; ComponentLink1Description: LM2596 Datasheet; ComponentLink2Description: LM2596 Web Page; DatasheetVersion: May-2002; ComponentLink3URL: http://www.national.com/packaging/folders/ts5b.html; ComponentLink3Description: TS5B Package Page; ComponentLink1URL: http://www.national.com/ds/LM/LM2596.pdf; ComponentLink2URL: http://www.national.com/pf/LM/LM2596.html; CompType: Switcher; Code_JEDEC: MO-169-AB; RevisionNote: Component URLs added; PackageVersion: revD, Apr-2005; PackageDescription: TO-263, Molded, .400 x .390 x .180in, 5 Lead, .067in Pitch, Surface Mount; PinCount: 5; RoHS: N; PackageReference: TS5B; PartNumber: LM2596S-5.0
U10 = 25LC512-E/SN: 512 Kbit SPI Bus Serial EEPROM, 8-Pin SOIC, Extended Temperature; Published: 29-Jan-2009; DatasheetVersion: revB, May-2008; PackageVersion: revAW, Oct-2008; PackageReference: SOIC-SN8; Publisher: Altium Limited; PackageDescription: 8-Lead Plastic Small Outline (SN) - Narrow, 3.90mm Body [SOIC]; Code_JEDEC: MS-012; Code_IPC: SOIC127P600-8; ComponentLink1Description: Manufacturer Link; ComponentLink1URL: http://www.microchip.com; ComponentLink2Description: Datasheet; ComponentLink2URL: http://ww1.microchip.com/downloads/en/DeviceDoc/22021E.pdf; ComponentLink3Description: Packaging Specification; ComponentLink3URL: http://ww1.microchip.com/downloads/en/PackagingSpec/00049AW.pdf
U11 = FS8205A: Optron
U15 = MCP6L01UT-E/OT: 1 MHz, 85 µA Op Amp, 5-Pin SOT-23, Extended Temperature Range, Tape and Reel; Published: 2-Dec-2009; DatasheetVersion: revA, Mar-2009; PackageVersion: revBB, Aug-2009; PackageReference: SOT-23-OT5; Publisher: Altium Limited; PackageDescription: 5-Lead Plastic Small Outline Transistor (OT) [SOT-23]; Supplier 1: Digi-Key; Supplier Part Number 1: MCP6L01UT-E/OTTR-ND; Supplier 2: Digi-Key; Supplier Part Number 2: MCP6L01UT-E/OTCT-ND; Supplier 3: Digi-Key; Supplier Part Number 3: MCP6L01UT-E/OTDKR-ND; Code_IPC: SOT23-5; ComponentLink1Description: Datasheet; ComponentLink1URL: http://ww1.microchip.com/downloads/en/DeviceDoc/22140a.pdf; ComponentLink2Description: Packaging Specification; ComponentLink2URL: http://www.microchip.com/stellent/groups/techpub_sg/documents/packagingspec/en012702.pdf; ComponentLink3Description: Microchip.com Home; ComponentLink3URL: http://www.microchip.com/
U20 = MCP73831T-2ACI/OT: Charger IC Lithium Ion/Polymer SOT-23-5; MF: Microchip; MP: MCP73831T-2ACI/OT; package: SOT-23 Microchip
U30 = A9G: Cellular, Navigation Beidou, GNSS, GPRS, GPS, GSM Transceiver Module 800MHz, 900MHz, 1.8GHz, 1.9GHz Antenna Not Included Surface Mount; MF: KEMET; MP: A9G
U50 = ESP32
U60 = CH340G: USB Interface Integrated Circuit; MF: WCH; MP: CH340G
U80 = ESDA6V1-5SC6: Array for ESD protection; Vendor: ST Microelectronics; Manufacturer_Part_Number: ESDA6V1-5SC6; Type: Type; RefDes: RefDes
U90 U91 = AMS1117: 1A LOW DROPOUT VOLTAGE REGULATOR SOT-223; MP: AMS1117; MF: SOT-223
U101 = MT3608: High Efficiency 1.2MHz 2A Step Up Converter; MF: Aerosemi Technology Co., Ltd; MB: MT3608
U130 = TL084CDT: General purpose JFET quad operational amplifiers; MP: TL084CDT
U140 = LM7812S/NOPB: 1.5-A, 30-V, linear voltage regulator 3-DDPAK/TO-263 0 to 125; MP: LM7812S/NOPB; pakage: 3-DDPAK/TO-263
U150 = 74HC14D: Inverter IC 6 Channel Schmitt Trigger 14-SOIC; MF: Toshiba; MP: 74HC14D
U152 = 74HC541D: Buffer, Non-Inverting 1 Element 8 Bit per Element 3-State Output 20-SOIC; MF: Toshiba Semiconductor; MP: 74HC541D
U300 = DW01A: Optron; MP: DW01A
X2 = Housing_2mm: Header, 2-Pin; LatestRevisionDate: 17-Jul-2002; LatestRevisionNote: Re-released for DXP Platform.; Publisher: Altium Limited
X3 = Conect_6: Header, 6-Pin; LatestRevisionDate: 17-Jul-2002; LatestRevisionNote: Re-released for DXP Platform.; Publisher: Altium Limited
X5 = Conect_3: Header, 3-Pin; LatestRevisionDate: 17-Jul-2002; LatestRevisionNote: Re-released for DXP Platform.; Publisher: Altium Limited
X6 = Housing: Header, 2-Pin; LatestRevisionDate: 17-Jul-2002; LatestRevisionNote: Re-released for DXP Platform.; Publisher: Altium Limited
Y1 = ABM8G25000MHZB4YT3: MF: Abracon; MP: ABM8G25000MHZB4YT3